# EAGLE design arduino tx (EAGLE 9.4.0)
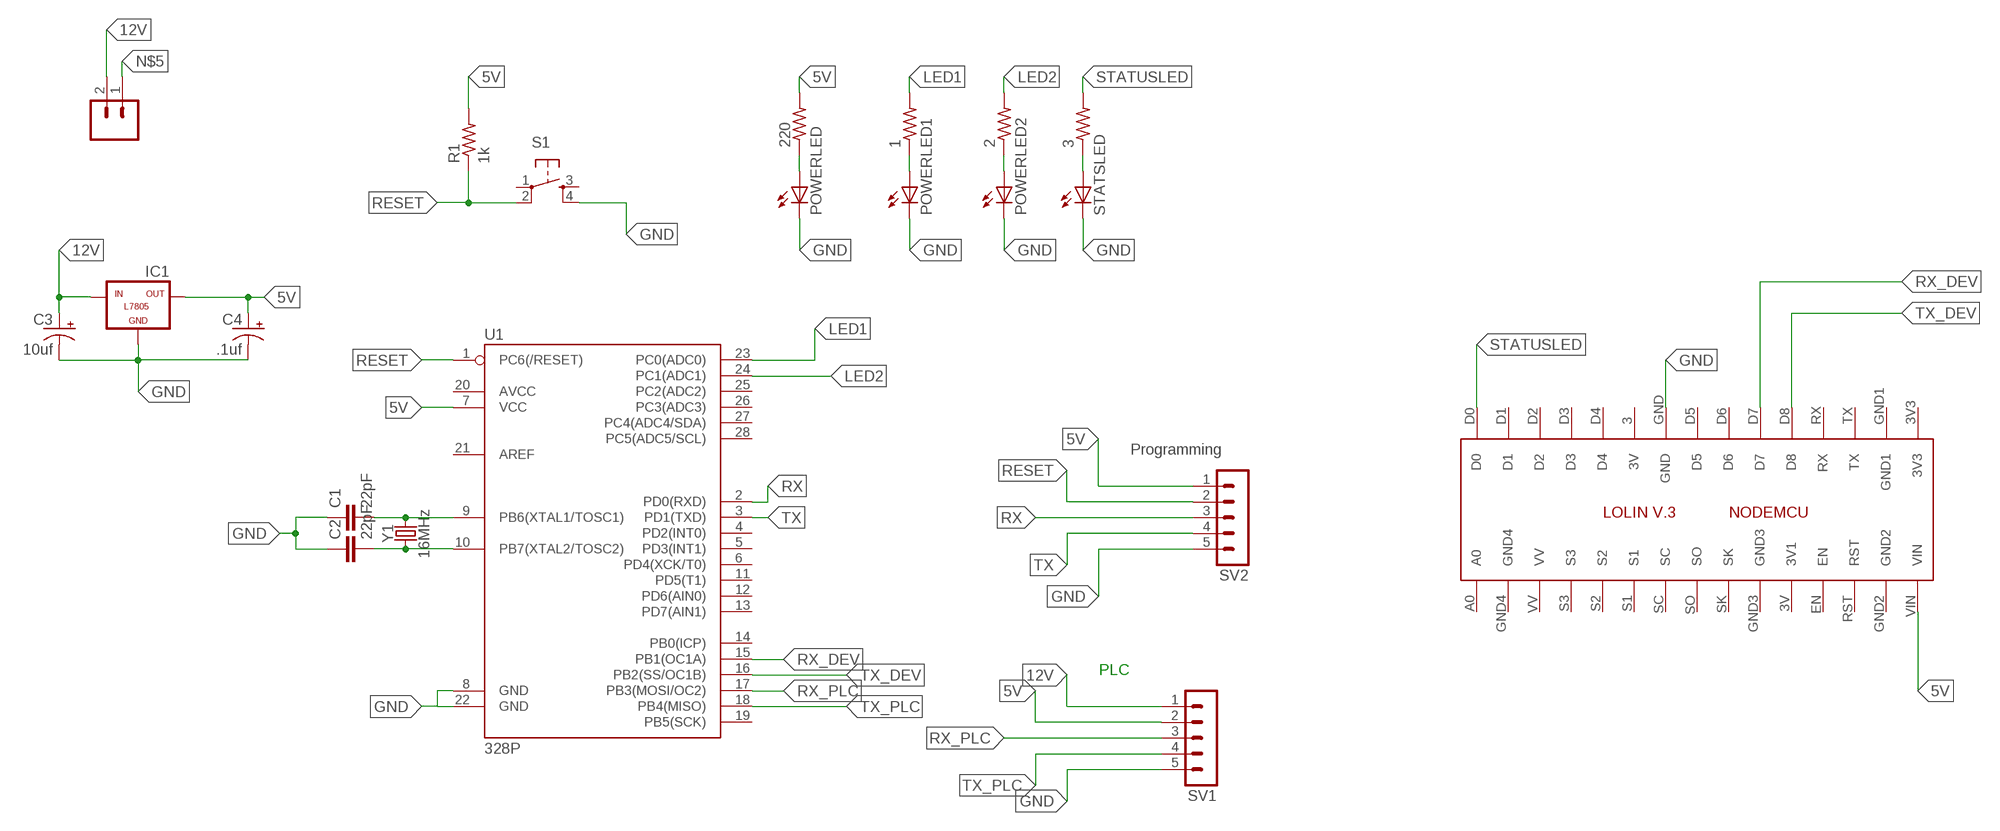
[diagram p0: schematic, sheet 1]

## Parts
1  R-US_0204/5  [0204/5]
2  R-US_0204/5  [0204/5]
3  R-US_0204/5  [0204/5]
220  R-US_0204/5  [0204/5]
C1  22pF  22PF-PTH-2.54MM-200V-5%  [CAP-PTH-2.54]
C2  22pF  22PF-PTH-2.54MM-200V-5%  [CAP-PTH-2.54]
C3  10uf  CPOL-USE5-5  [E5-5]
C4  .1uf  CPOL-USE5-5  [E5-5]
IC1  L7805  [78XXL]
IC2  NODEMCU_LOLINV3  [NODEMCU_LOLINV3]
J1  CONN_025MM  [SCREWTERMINAL-5MM-2]
POWERLED  LED5MM  [LED5MM]
POWERLED1  LED5MM  [LED5MM]
POWERLED2  LED5MM  [LED5MM]
R1  1k  R-US_0204/5  [0204/5]
S1  TAC_SWITCHPTH  [TACTILE-PTH]
STATSLED  LED5MM  [LED5MM]
SV1  MA05-1  [MA05-1]
SV2  MA05-1  [MA05-1]
U1  328P  ATMEGA328P_PDIP  [DIP28]
Y1  16MHz  CRYSTAL-16MHZPTH-HC49US  [HC49US]

## Nets
5V: 220.2 C4.+ IC1.OUT IC2.VIN R1.2 SV1.2 SV2.1 U1.7(VCC)
12V: C3.+ IC1.IN J1.2 SV1.1
GND: C1.1 C2.1 C3.- C4.- IC1.GND IC2.GND POWERLED1.K(C) POWERLED2.K(C) POWERLED.K(C) S1.4 STATSLED.K(C) SV1.5 SV2.5 U1.8(GND) U1.22(GND)
LED1: 1.2 U1.23(PC0(ADC0))
LED2: 2.2 U1.24(PC1(ADC1))
N$1: 220.1 POWERLED.A
N$2: C1.2 U1.9(PB6(XTAL1/TOSC1)) Y1.2
N$3: C2.2 U1.10(PB7(XTAL2/TOSC2)) Y1.1
N$5: J1.1
N$16: 1.1 POWERLED1.A
N$17: 2.1 POWERLED2.A
N$18: 3.1 STATSLED.A
RESET: R1.1 S1.2 SV2.2 U1.1(PC6(/RESET))
RX: SV2.3 U1.2(PD0(RXD))
RX_DEV: IC2.D7 U1.15(PB1(OC1A))
RX_PLC: SV1.3 U1.17(PB3(MOSI/OC2))
STATUSLED: 3.2 IC2.D0
TX: SV2.4 U1.3(PD1(TXD))
TX_DEV: IC2.D8 U1.16(PB2(SS/OC1B))
TX_PLC: SV1.4 U1.18(PB4(MISO))
Unconnected: IC2.3(3V) IC2.3V3 IC2.3V(3V1) IC2.A0 IC2.D1 IC2.D2 IC2.D3 IC2.D4 IC2.D5 IC2.D6 IC2.EN IC2.GND1 IC2.GND2 IC2.GND3 IC2.GND4 IC2.RST IC2.RX IC2.S1 IC2.S2 IC2.S3 IC2.SC IC2.SK IC2.SO IC2.TX IC2.VV S1.1 S1.3 U1.4(PD2(INT0)) U1.5(PD3(INT1)) U1.6(PD4(XCK/T0)) U1.11(PD5(T1)) U1.12(PD6(AIN0)) U1.13(PD7(AIN1)) U1.14(PB0(ICP)) U1.19(PB5(SCK)) U1.20(AVCC) U1.21(AREF) U1.25(PC2(ADC2)) U1.26(PC3(ADC3)) U1.27(PC4(ADC4/SDA)) U1.28(PC5(ADC5/SCL))

## Notes on the sheet
- Programming
- PLC

## Library data of the parts
1-3 220 R1 = adafruit:R-US_: RESISTOR, American symbol
C1 C2 = SparkFun-Capacitors:22PF: 22pF ceramic capacitors A capacitor is a passive two-terminal electrical component used to store electrical energy temporarily in an electric field.; PROD_ID: CAP-09128
C3 C4 = adafruit:CPOL-US: POLARIZED CAPACITOR, American symbol
IC1 = tango:L7805: VOLTAGE REGULATOR
IC2 = Lolin:NODEMCU_LOLINV3
J1 = SparkFun-Connectors:CONN_02: Multi connection point. Often used as Generic Header-pin footprint for 0.1 inch spaced/style header connections On any of the 0.1 inch spaced packages, you can populate with these: Break Away Headers - Straight <https://www.sparkfun.com/products/116> (PRT-00116) Break Away Male Headers - Right Angle <https://www.sparkfun.com/products/553> (PRT-00553) Female Headers <https://www.sparkfun.com/products/115> (PRT-00115) Break Away Headers - Machine Pin <https://www.sparkfun.com/products/117> (PRT-00117) Break Away Female Headers - Swiss Machine Pin <https://www.sparkfun.com/products/743> (PRT-00743) For SCREWTERMINALS and SPRING TERMINALS visit here: Screw Terimnals on SparkFun.com <https://www.sparkfun.com/search/results?term=Screw+Terminals> (5mm/3.5mm/2.54mm spacing) This device is also useful as a general connection point to wire up your design to another part of your project. Our various solder wires solder well into these plated through hole pads. Hook-Up Wire - Assortment (Stranded, 22 AWG) <https://www.sparkfun.com/products/11375> (PRT-11375) Hook-Up Wire - Assortment (Solid Core, 22 AWG) <https://www.sparkfun.com/products/11367> (PRT-11367) View the entire wire category on our website here <https://www.sparkfun.com/categories/141> Special notes: Molex polarized connector foot print use with: PRT-08233 with associated crimp pins and housings. 2.54_SCREWTERM for use with PRT-10571. 3.5mm Screw Terminal footprints for PRT-08084 5mm Screw Terminal footprints for use with PRT-08432; SF_SKU: PRT-08432
POWERLED POWERLED1 POWERLED2 STATSLED = adafruit:LED: LED OSRAM: - CHIPLED LG R971, LG N971, LY N971, LG Q971, LY Q971, LO R971, LY R971 LH N974, LH R974 LS Q976, LO Q976, LY Q976 LO Q996 - Hyper CHIPLED LW Q18S LB Q993, LB Q99A, LB R99A - SideLED LS A670, LO A670, LY A670, LG A670, LP A670 LB A673, LV A673, LT A673, LW A673 LH A674 LY A675 LS A676, LA A676, LO A676, LY A676, LW A676 LS A679, LY A679, LG A679 - Hyper Micro SIDELED® LS Y876, LA Y876, LO Y876, LY Y876 LT Y87S - SmartLED LW L88C, LW L88S LB L89C, LB L89S, LG L890 LS L89K, LO L89K, LY L89K LS L896, LA L896, LO L896, LY L896 - TOPLED LS T670, LO T670, LY T670, LG T670, LP T670 LSG T670, LSP T670, LSY T670, LOP T670, LYG T670 LG T671, LOG T671, LSG T671 LB T673, LV T673, LT T673, LW T673 LH T674 LS T676, LA T676, LO T676, LY T676, LB T676, LH T676, LSB T676, LW T676 LB T67C, LV T67C, LT T67C, LS T67K, LO T67K, LY T67K, LW E67C LS E67B, LA E67B, LO E67B, LY E67B, LB E67C, LV E67C, LT E67C LW T67C LS T679, LY T679, LG T679 LS T770, LO T770, LY T770, LG T770, LP T770 LB T773, LV T773, LT T773, LW T773 LH T774 LS E675, LA E675, LY E675, LS T675 LS T776, LA T776, LO T776, LY T776, LB T776 LHGB T686 LT T68C, LB T68C - Hyper Mini TOPLED® LB M676 - Mini TOPLED Santana® LG M470 LS M47K, LO M47K, LY M47K Source: http://www.osram.convergy.de/
S1 = SparkFun-Retired:TAC_SWITCH: Momentary Switch Button commonly used for reset or general input. Spark Fun Electronics SKU : COM-00097 SMT- SWCH-08247
SV1 SV2 = con-lstb:MA05-1: PIN HEADER; OC_FARNELL: unknown; OC_NEWARK: unknown
U1 = SparkFun-IC-Microcontroller:ATMEGA328P_PDIP: Atmel 328P Through hole ATMEGA328P uC used in the Arduino 32kb flash, 1k EEPROM, 2k SRAM Datasheet <http://www.sparkfun.com/datasheets/Components/SMD/ATMega328.pdf> SparkFun Products Storefront component: AVR 28 Pin 20MHz 32K 6A/D - ATMega328P <https://www.sparkfun.com/products/9061> (COM-09061) SparkFun Simon Says - Through-Hole Soldering Kit <https://www.sparkfun.com/products/10547> (KIT-10547) SparkFun Learn to Solder - Simon Says <https://www.sparkfun.com/products/13708> (KIT-13708) SparkFun BigTime Watch Kit <https://www.sparkfun.com/products/11734> (KIT-11734) SparkFun ClockIt <https://www.sparkfun.com/products/10930> (KIT-10930) SparkFun Serial Enabled LCD Kit <https://www.sparkfun.com/products/10097> (LCD-10097) SparkFun Simon Tilts - Through Hole Soldering Kit <https://www.sparkfun.com/products/12634> (KIT-12634) SparkFun Frequency Counter Kit <https://www.sparkfun.com/products/10140> (KIT-10140) FabFM Radio Kit <https://www.sparkfun.com/products/11043> (KIT-11043) SparkFun Binary Blaster Kit <https://www.sparkfun.com/products/12037> (KIT-12037) SparkFun Metro-Gnome <https://www.sparkfun.com/products/9236> (KIT-09236) ATmega328 with Arduino Optiboot (Uno) <https://www.sparkfun.com/products/10524> (DEV-10524); PROD_ID: IC-09136
Y1 = SparkFun-Clocks:CRYSTAL-16MHZ: 16MHz Crystal Digikey Example <http://www.digikey.com/product-search/en?keywords=535-9122-1-ND> Frequency: 16MHz Frequency Stability: ±50ppm Frequency Tolerance: ±20ppm Load Capacitance: 18pF SparkFun Products: Pro Micro -5V/16MHz <https://www.sparkfun.com/products/12640> SparkFun Serial Enabled LCD Kit <https://www.sparkfun.com/products/10097>; PROD_ID: XTAL-08181; SF_ID: COM-00536

## Board
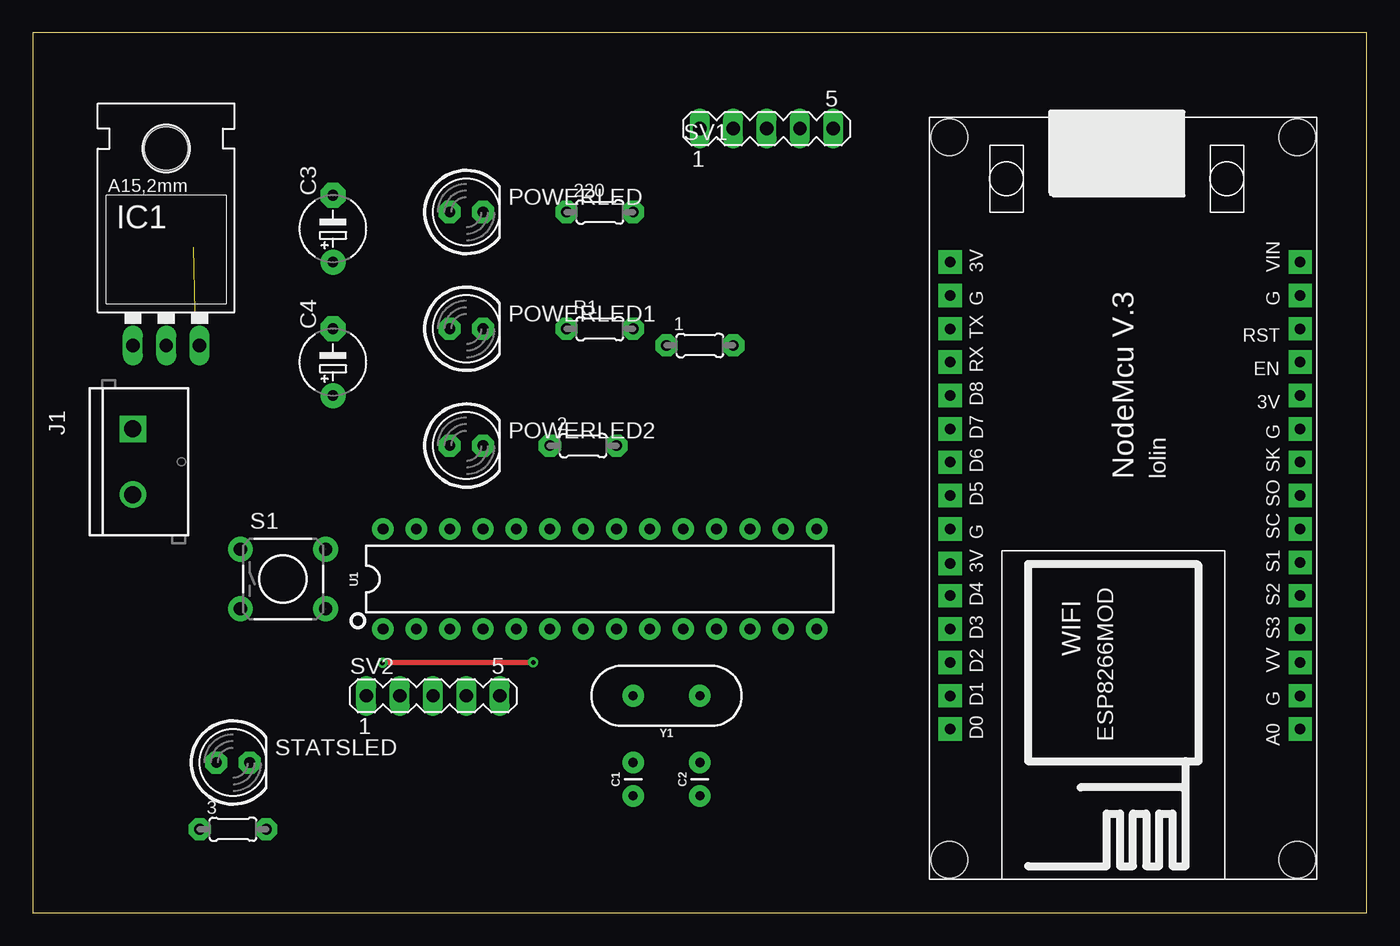
[diagram p1: board, top side]
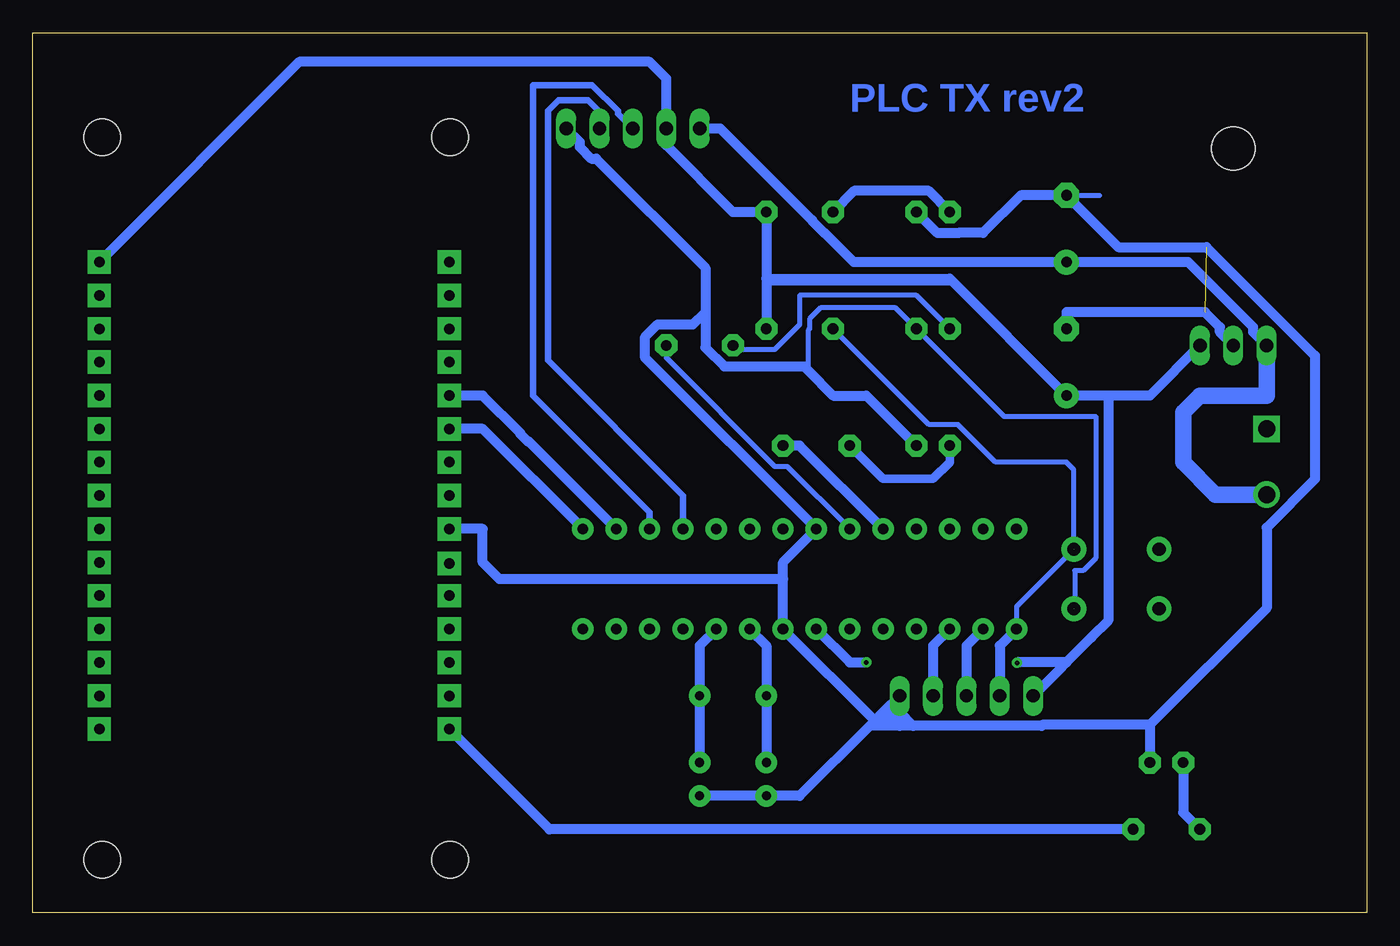
[diagram p2: board, bottom side, seen from below]

Size 101.58 x 66.98 mm. Coordinates in mm from the lower left corner, seen from the top.
Outline: 0,0 101.58,0 101.58,66.98 0,66.98 0,0
Copper layers (1*16): Top 0.035mm / dielectric 1.5mm / Bottom 0.035mm
Design rules "default *": minimum track width 15mil, minimum drill 0.35mm, track to track 15mil, track to pad 15mil, pad to pad 6mil, via to via 6mil, smd to smd 6mil, copper to edge 20mil, drill to drill 6mil, minimum pad ring 10mil, minimum via ring 8mil, stop-mask expansion 4mil, vias tented up to drill 0mil, thermal gap 10mil

### Footprints (pad centres in the part's own frame; a part is rotated, then mirrored left to right if it is on the bottom)
0204/5 = drill 0.813 pad 1.676 octagon: 1 -2.54,0; 2 2.54,0
CAP-PTH-2.54 = drill 0.7 pad 1.651: 1 -1.27,0; 2 1.27,0
E5-5 = drill 0.813 pad 1.905: + -2.54,0 | drill 0.813 pad 1.905 octagon: - 2.54,0
78XXL = drill 1.016 long: GND 0,-3.81; IN -2.54,-3.81; OUT 2.54,-3.81 | hole 3.302: 0,11.176
NODEMCU_LOLINV3 = drill 0.8 pad 1.778 square: 3 24.03,27.94; 3V 46.99,27.94; 3V3 36.83,1.27; A0 11.43,1.27; D0 11.43,27.94; D1 13.97,27.94; D2 16.51,27.94; D3 19.05,27.94; D4 21.59,27.94; D5 29.21,27.94; D6 31.75,27.94; D7 34.29,27.94; D8 36.83,27.94; EN 39.37,1.27; GND 26.67,27.94; GND1 44.45,27.94; GND2 44.45,1.27; GND3 34.29,1.27; GND4 13.97,1.27; RST 41.91,1.27; RX 39.37,27.94; S1 24.13,1.27; S2 21.59,1.27; S3 19.05,1.27; SC 26.67,1.27; SK 31.75,1.27; SO 29.21,1.27; TX 41.91,27.94; VIN 46.99,1.27; VV 16.51,1.27 | hole 2.8: 56.5,28; 56.5,1.5; 1.5,1.5; 1.5,28
SCREWTERMINAL-5MM-2 = drill 1.3 pad 2.032 square: 1 0,0 | drill 1.3 pad 2.032: 2 5,0
LED5MM = drill 0.813 pad 1.676 octagon: A -1.27,0; K 1.27,0
TACTILE-PTH = drill 1.016 pad 1.88: 1 -3.251,2.261; 2 3.251,2.261; 3 -3.251,-2.261; 4 3.251,-2.261
MA05-1 = drill 1.016 long: 1 -5.08,0; 2 -2.54,0; 3 0,0; 4 2.54,0; 5 5.08,0
DIP28 = drill 0.813 pad 1.626: 1 -16.51,-3.81; 2 -13.97,-3.81; 3 -11.43,-3.81; 4 -8.89,-3.81; 5 -6.35,-3.81; 6 -3.81,-3.81; 7 -1.27,-3.81; 8 1.27,-3.81; 9 3.81,-3.81; 10 6.35,-3.81; 11 8.89,-3.81; 12 11.43,-3.81; 13 13.97,-3.81; 14 16.51,-3.81; 15 16.51,3.81; 16 13.97,3.81; 17 11.43,3.81; 18 8.89,3.81; 19 6.35,3.81; 20 3.81,3.81; 21 1.27,3.81; 22 -1.27,3.81; 23 -3.81,3.81; 24 -6.35,3.81; 25 -8.89,3.81; 26 -11.43,3.81; 27 -13.97,3.81; 28 -16.51,3.81
HC49US = drill 0.7 pad 1.651: 1 -2.54,0; 2 2.54,0

### Placement (x,y rotation side)
1  50.8,43.18 0 top
2  41.91,35.56 0 top
3  15.24,6.35 0 top
220  43.18,53.34 0 top
C1  45.72,10.16 90 top
C2  50.8,10.16 90 top
C3  22.86,52.07 90 top
C4  22.86,41.91 90 top
IC1  10.16,46.99 0 top
IC2  97.79,2.54 90 top
J1  7.62,36.83 270 top
POWERLED  33.02,53.34 0 top
POWERLED1  33.02,44.45 0 top
POWERLED2  33.02,35.56 0 top
R1  43.18,44.45 0 top
S1  19.05,25.4 0 top
STATSLED  15.24,11.43 0 top
SV1  55.88,59.69 0 top
SV2  30.48,16.51 0 top
U1  43.18,25.4 0 top
Y1  48.26,16.51 180 top

### Tracks (layer width: path | path; a pad name or v marks a point on that pad's centre or on a via)
5V  (via drill 0.35)  (1 unrouted)
  Top 0.381: v26.63,19.01 26.67,19.05 v38.1,19.05
  Bottom 0.381: 16.51,39.37 19.68,39.37 C4.+ 31.43,47.94 45.72,47.94 | 53.34,58.42 SV1.2 53.34,60.64 | 45.72,48.26 45.72,47.94 | 45.72,47.94 R1.2 | SV2.1 22.86,19.05 20.95,20.95 | 26.67,19.05 v26.63,19.01
  Bottom 0.762: 45.72,48.26 220.2 48.26,53.34 53.34,58.42 | 45.72,48.26 R1.2 | IC1.OUT 16.51,39.37 C4.+ 31.75,48.26 45.72,48.26 | SV1.2 53.34,63.5 54.61,64.77 81.28,64.77 IC2.VIN | U1.7 39.37,19.05 v38.1,19.05 | 19.68,39.37 19.68,22.22 20.95,20.95 SV2.1 | 22.86,19.05 26.59,19.05 v26.63,19.01
12V
  Bottom 0.762: IC1.IN 8.64,44.2 8.64,44.57 13.59,49.53 C3.+ 39.05,49.53 41.26,51.74 41.3,51.74 42.24,52.68 42.24,52.72 49.21,59.69 SV1.1
  Bottom 1.27: IC1.IN 7.62,39.37 12.7,39.37 13.97,38.1 13.97,34.29 11.51,31.83 J1.2
GND  (2 unrouted)
  Bottom 0.381: S1.4 22.23,23.19 22.22,26.04 21.59,26.04 20.64,26.99 20.64,37.78 27.62,37.78 POWERLED1.K 35.88,46.04 41.59,46.04 42.42,45.21 42.42,44.45 42.55,44.33 42.55,41.28 | 37.85,14.22 37.78,14.29 | 37.78,14.29 37.46,14.61 | 43.18,8.89 C1.1 C2.1 | 37.78,14.29 36.83,14.29 35.56,14.29 16.51,14.29 | C3.- 20.32,54.61
  Bottom 0.762: POWERLED.K 32.69,51.74 31.09,51.74 31.07,51.75 29.21,51.75 26.35,54.61 C3.- 18.92,50.67 12.2,50.67 3.94,42.41 3.94,33 7.62,29.32 7.62,23.18 16.51,14.29 | IC1.GND 11.18,44.2 11.18,44.57 12.32,45.72 22.86,45.72 C4.- | 44.45,25.4 U1.8 37.46,14.61 | 44.45,25.4 44.45,26.67 U1.22 54.94,42.24 54.94,43.84 54,44.78 51.3,44.78 50.36,45.72 | 44.45,25.4 66.04,25.4 67.31,26.67 67.31,29.21 IC2.GND | SV1.5 59.94,58.67 59.94,58.3 59.05,57.4 58.67,57.4 50.36,49.09 50.36,45.72 | POWERLED2.K 38.1,39.37 40.64,39.37 42.55,41.28 42.85,41.58 48.92,41.58 50.36,43.02 50.36,45.72 | 16.51,14.29 STATSLED.K | 16.51,14.29 24.7,14.29 24.77,14.22 34.54,14.22 | 34.54,14.22 35.56,15.24 | 34.54,14.22 35.56,14.22 | 35.56,14.22 37.85,14.22 | 37.85,14.22 43.18,8.89 C2.1 | 35.56,15.24 SV2.5 36.83,15.24 | 35.56,15.24 35.56,14.29 | 35.56,14.22 36.58,15.24 | 36.58,15.24 35.56,15.24 | 37.85,14.22 37.46,14.61 | 37.46,14.61 36.83,15.24 | 36.83,15.24 36.58,15.24 | 36.58,15.24 36.83,14.99 36.83,14.29
LED1
  Bottom 0.381: U1.23 44.13,33.97 45.09,33.97 53.34,42.23 1.2
LED2
  Bottom 0.762: U1.24 43.18,35.56 2.2
N$1
  Bottom 0.762: POWERLED.A 33.35,54.94 39.04,54.94 220.1
N$2
  Bottom 0.762: C1.2 Y1.2 45.72,20.32 U1.9
N$3
  Bottom 0.762: C2.2 Y1.1 50.8,20.32 U1.10
N$16
  Bottom 0.381: 1.1 47.94,42.86 45.09,42.86 43.18,44.77 43.18,46.99 34.29,46.99 POWERLED1.A
N$17
  Bottom 0.635: POWERLED2.A 31.75,34.29 33.02,33.02 34.29,33.02 36.83,33.02 2.1
N$18
  Bottom 0.762: STATSLED.A 13.97,7.62 3.1
RESET  (1 unrouted)
  Bottom 0.381: R1.1 33.34,37.15 31.11,37.15 28.26,34.29 22.86,34.29 22.3,33.73 S1.2 26.67,23.29 U1.1
  Bottom 0.762: U1.1 27.94,20.32 SV2.2
RX
  Bottom 0.762: U1.2 30.48,20.32 SV2.3
RX_DEV
  Bottom 0.762: U1.15 67.31,36.83 IC2.D7
RX_PLC
  Bottom 0.508: SV1.3 57.02,60.83 57.02,61.03 58.98,62.99 63.5,62.99 63.5,39.37 54.61,30.48 U1.17
STATUSLED
  Bottom 0.762: 3.2 62.23,6.35 IC2.D0
TX
  Bottom 0.762: U1.3 33.02,20.32 SV2.4
TX_DEV
  Bottom 0.762: IC2.D8 67.31,39.37 64.45,36.51 64.45,36.44 63.89,35.88 63.82,35.88 U1.16
TX_PLC
  Bottom 0.508: SV1.4 58.42,60.96 59.31,61.85 61.54,61.85 62.36,61.03 62.36,42.04 52.07,31.75 U1.18

### Text on the board
Bottom: PLC TX rev2